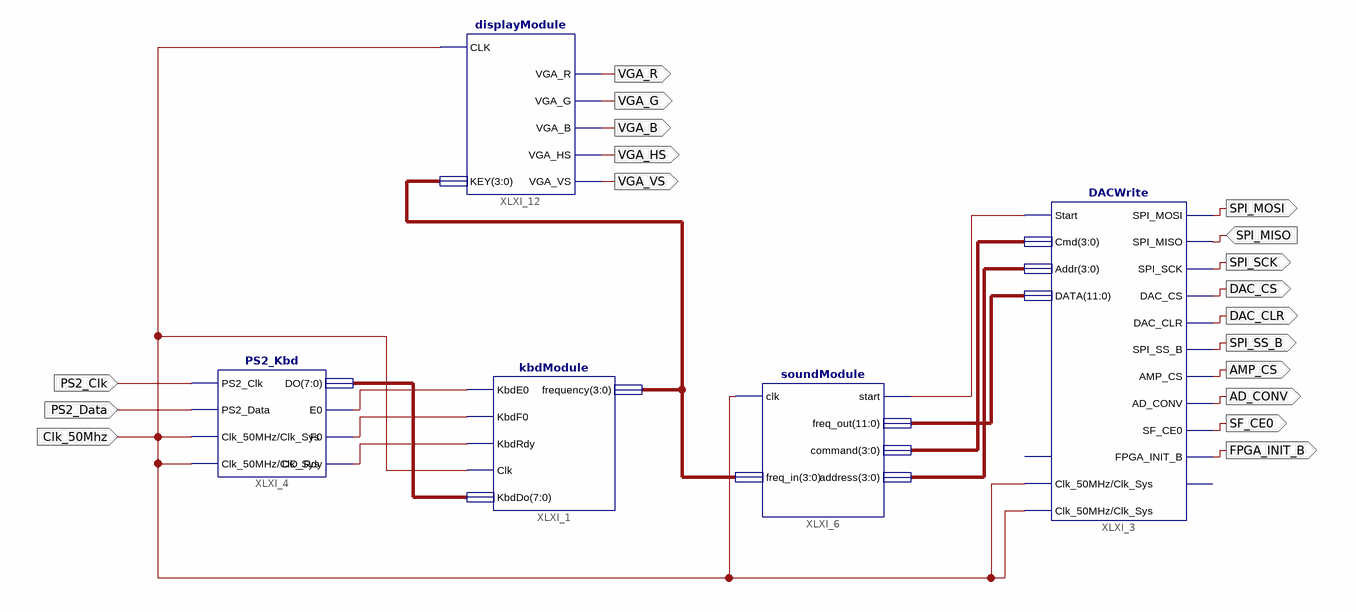
[diagram p0: schematic sheet 1]
// Xilinx ISE schematic mainScheme.sch (spartan3e) as structural Verilog: 5 symbols, 18 ports
module mainScheme (
  input  Clk_50Mhz,
  input  SPI_MISO,
  input  PS2_Clk,
  input  PS2_Data,
  output SPI_MOSI,
  output SPI_SCK,
  output DAC_CS,
  output DAC_CLR,
  output SPI_SS_B,
  output AMP_CS,
  output AD_CONV,
  output SF_CE0,
  output FPGA_INIT_B,
  output VGA_R,
  output VGA_G,
  output VGA_B,
  output VGA_HS,
  output VGA_VS
);

  wire XLXN_4, XLXN_7, XLXN_8, XLXN_9;
  wire [3:0] test_out, XLXN_1, XLXN_2;
  wire [7:0] XLXN_6;
  wire [11:0] XLXN_13;

  kbdModule XLXI_1 (
    .KbdE0(XLXN_7), .KbdF0(XLXN_8), .KbdRdy(XLXN_9), .Clk(Clk_50Mhz), .KbdDo(XLXN_6), .frequency(test_out));
  DACWrite XLXI_3 (
    .Start(XLXN_4), .SPI_MISO(SPI_MISO), .Cmd(XLXN_1), .Addr(XLXN_2), .DATA(XLXN_13), .DAC_CLR(DAC_CLR),
    .DAC_CS(DAC_CS), .SPI_MOSI(SPI_MOSI), .SPI_SCK(SPI_SCK), .SPI_SS_B(SPI_SS_B), .AMP_CS(AMP_CS),
    .AD_CONV(AD_CONV), .SF_CE0(SF_CE0), .FPGA_INIT_B(FPGA_INIT_B), .Clk_50MHz(Clk_50Mhz), .Clk_Sys(Clk_50Mhz));  // open: Reset, Busy
  PS2_Kbd XLXI_4 (
    .PS2_Clk(PS2_Clk), .PS2_Data(PS2_Data), .Clk_50MHz(Clk_50Mhz), .E0(XLXN_7), .F0(XLXN_8), .DO_Rdy(XLXN_9),
    .DO(XLXN_6), .Clk_Sys(Clk_50Mhz));
  soundModule XLXI_6 (
    .clk(Clk_50Mhz), .freq_in(test_out), .start(XLXN_4), .freq_out(XLXN_13), .command(XLXN_1),
    .address(XLXN_2));
  displayModule XLXI_12 (
    .CLK(Clk_50Mhz), .KEY(test_out), .VGA_R(VGA_R), .VGA_G(VGA_G), .VGA_B(VGA_B), .VGA_HS(VGA_HS),
    .VGA_VS(VGA_VS));
endmodule
